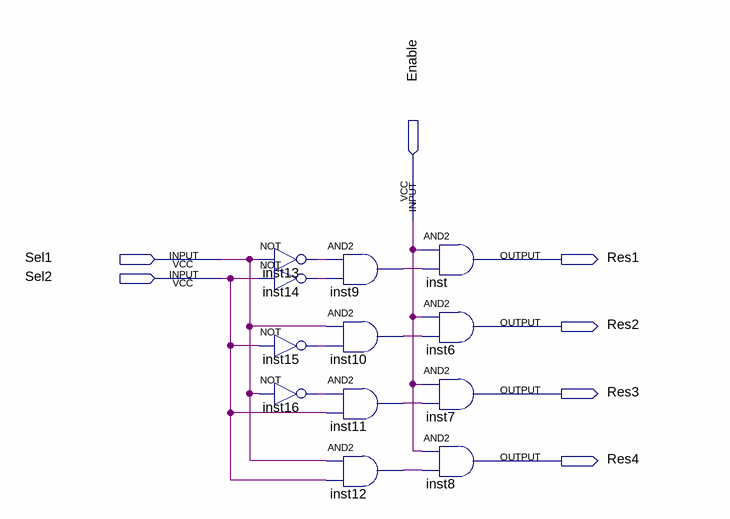
[diagram p0: schematic sheet]
// Quartus schematic Select4.bdf as structural Verilog: 12 symbols, 7 pins
module Select4 (
  input  Enable,
  input  Sel1,
  input  Sel2,
  output Res1,
  output Res2,
  output Res3,
  output Res4
);

  wire inst9_out, inst10_out, inst11_out, inst12_out, inst13_out, inst14_out, inst15_out, inst16_out;

  not inst13 (inst13_out, Sel1);
  not inst14 (inst14_out, Sel2);
  not inst15 (inst15_out, Sel2);
  not inst16 (inst16_out, Sel1);
  and inst9 (inst9_out, inst13_out, inst14_out);
  and inst10 (inst10_out, Sel1, inst15_out);
  and inst11 (inst11_out, inst16_out, Sel2);
  and inst12 (inst12_out, Sel1, Sel2);
  and inst (Res1, Enable, inst9_out);
  and inst6 (Res2, Enable, inst10_out);
  and inst7 (Res3, Enable, inst11_out);
  and inst8 (Res4, Enable, inst12_out);
endmodule
